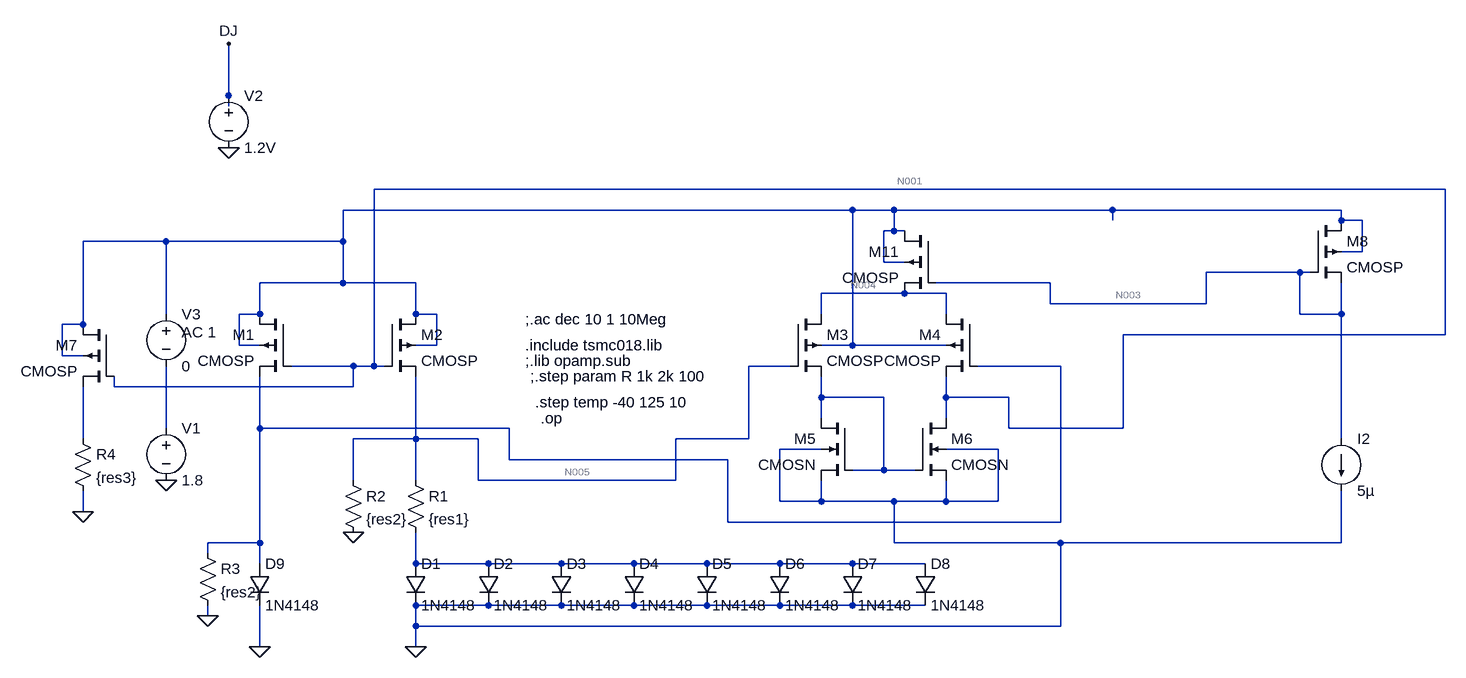
[diagram p0: schematic project1.asc]
project1.asc, the LTspice schematic file:
Version 4.1
SHEET 1 1508 680
WIRE -368 -320 -368 -400
WIRE -368 -304 -368 -320
WIRE 1504 -176 -144 -176
WIRE 592 -144 -192 -144
WIRE 656 -144 592 -144
WIRE 992 -144 656 -144
WIRE 1344 -144 992 -144
WIRE 992 -128 992 -144
WIRE 1344 -128 1344 -144
WIRE 1376 -128 1344 -128
WIRE 656 -112 656 -144
WIRE 656 -112 640 -112
WIRE 672 -112 656 -112
WIRE -464 -96 -592 -96
WIRE -192 -96 -192 -144
WIRE -192 -96 -464 -96
WIRE 1376 -80 1376 -128
WIRE 1376 -80 1344 -80
WIRE 640 -64 640 -112
WIRE 672 -64 640 -64
WIRE 1280 -48 1136 -48
WIRE 1296 -48 1280 -48
WIRE -192 -32 -192 -96
WIRE -192 -32 -320 -32
WIRE -80 -32 -192 -32
WIRE 896 -32 720 -32
WIRE 672 -16 544 -16
WIRE 736 -16 672 -16
WIRE 896 0 896 -32
WIRE 1136 0 1136 -48
WIRE 1136 0 896 0
WIRE -464 16 -464 -96
WIRE -320 16 -320 -32
WIRE -320 16 -352 16
WIRE -80 16 -80 -32
WIRE -48 16 -80 16
WIRE 544 16 544 -16
WIRE 736 16 736 -16
WIRE 1280 16 1280 -48
WIRE 1344 16 1344 -32
WIRE 1344 16 1280 16
WIRE -592 32 -592 -96
WIRE -592 32 -624 32
WIRE 1504 48 1504 -176
WIRE 1504 48 1008 48
WIRE -352 64 -352 16
WIRE -320 64 -352 64
WIRE -48 64 -48 16
WIRE -48 64 -80 64
WIRE 592 64 592 -144
WIRE 592 64 544 64
WIRE 736 64 592 64
WIRE -624 80 -624 32
WIRE -592 80 -624 80
WIRE -176 96 -272 96
WIRE -144 96 -144 -176
WIRE -144 96 -176 96
WIRE -128 96 -144 96
WIRE 496 96 432 96
WIRE 912 96 784 96
WIRE -544 128 -544 112
WIRE -176 128 -176 96
WIRE -176 128 -544 128
WIRE 544 144 544 112
WIRE 640 144 544 144
WIRE 736 144 736 112
WIRE 832 144 736 144
WIRE 544 176 544 144
WIRE 736 176 736 144
WIRE -464 192 -464 96
WIRE -320 192 -320 112
WIRE 64 192 -320 192
WIRE 832 192 832 144
WIRE 1008 192 1008 48
WIRE 1008 192 832 192
WIRE -592 208 -592 128
WIRE -80 208 -80 112
WIRE -80 208 -176 208
WIRE 16 208 -80 208
WIRE 432 208 432 96
WIRE 432 208 320 208
WIRE 1344 208 1344 16
WIRE 544 224 480 224
WIRE 816 224 736 224
WIRE 64 240 64 192
WIRE 400 240 64 240
WIRE 640 256 640 144
WIRE 640 256 592 256
WIRE 688 256 640 256
WIRE -176 272 -176 208
WIRE -80 272 -80 208
WIRE 16 272 16 208
WIRE 320 272 320 208
WIRE 320 272 16 272
WIRE 480 304 480 224
WIRE 544 304 544 272
WIRE 544 304 480 304
WIRE 656 304 544 304
WIRE 736 304 736 272
WIRE 736 304 656 304
WIRE 816 304 816 224
WIRE 816 304 736 304
WIRE -592 320 -592 288
WIRE 400 336 400 240
WIRE 912 336 912 96
WIRE 912 336 400 336
WIRE -320 368 -320 192
WIRE -320 368 -400 368
WIRE 656 368 656 304
WIRE 912 368 656 368
WIRE 1344 368 1344 288
WIRE 1344 368 912 368
WIRE -400 384 -400 368
WIRE -320 400 -320 368
WIRE -80 400 -80 352
WIRE 32 400 -80 400
WIRE 144 400 32 400
WIRE 256 400 144 400
WIRE 368 400 256 400
WIRE 480 400 368 400
WIRE 592 400 480 400
WIRE 704 400 592 400
WIRE 32 464 -80 464
WIRE 144 464 32 464
WIRE 256 464 144 464
WIRE 368 464 256 464
WIRE 480 464 368 464
WIRE 592 464 480 464
WIRE 704 464 592 464
WIRE -400 480 -400 464
WIRE -80 496 -80 464
WIRE 912 496 912 368
WIRE 912 496 -80 496
WIRE -320 528 -320 464
WIRE -80 528 -80 496
FLAG -80 528 0
FLAG -320 528 0
FLAG -464 272 0
FLAG -176 352 0
FLAG -400 480 0
FLAG -592 320 0
FLAG -368 -400 DJ
FLAG -368 -240 0
SYMBOL cmosp -272 16 M0
SYMATTR InstName M1
SYMATTR Value2 l=0.3u w=1u ad=0.36e-12 as=0.36e-12 pd=2.72e-6 ps=2.72e-6 m={current_mirror}
SYMBOL cmosp -128 16 R0
SYMATTR InstName M2
SYMATTR Value2 l=0.3u w=1u ad=0.36e-12 as=0.36e-12 pd=2.72e-6 ps=2.72e-6 m={current_mirror}
SYMBOL res -96 256 R0
SYMATTR InstName R1
SYMATTR Value {res1}
SYMBOL diode -96 400 R0
SYMATTR InstName D1
SYMATTR Value 1N4148
SYMBOL diode 16 400 R0
SYMATTR InstName D2
SYMATTR Value 1N4148
SYMBOL diode 128 400 R0
SYMATTR InstName D3
SYMATTR Value 1N4148
SYMBOL diode 240 400 R0
SYMATTR InstName D4
SYMATTR Value 1N4148
SYMBOL diode 352 400 R0
SYMATTR InstName D5
SYMATTR Value 1N4148
SYMBOL diode 464 400 R0
SYMATTR InstName D6
SYMATTR Value 1N4148
SYMBOL diode 576 400 R0
SYMATTR InstName D7
SYMATTR Value 1N4148
SYMBOL diode 688 400 R0
SYMATTR InstName D8
SYMATTR Value 1N4148
SYMBOL voltage -464 176 R0
WINDOW 123 0 0 Left 0
WINDOW 39 0 0 Left 0
SYMATTR InstName V1
SYMATTR Value 1.8
SYMBOL diode -336 400 R0
SYMATTR InstName D9
SYMATTR Value 1N4148
SYMBOL cmosp 496 16 R0
SYMATTR InstName M3
SYMATTR Value2 l=0.3u w=1u ad=0.36e-12 as=0.36e-12 pd=2.72e-06 ps=2.72e-06 m={input}
SYMBOL cmosp 784 16 M0
SYMATTR InstName M4
SYMATTR Value2 l=0.3u w=1u ad=0.36e-12 as=0.36e-12 pd=2.72e-06 ps=2.72e-06 m={input}
SYMBOL cmosn 592 176 M0
SYMATTR InstName M5
SYMATTR Value2 l=0.3u w=1u ad=0.36e-12 as=0.36e-12 pd=2.72e-06 ps=2.72e-06 m={active}
SYMBOL cmosn 688 176 R0
SYMATTR InstName M6
SYMATTR Value2 l=0.3u w=1u ad=0.36e-12 as=0.36e-12 pd=2.72e-06 ps=2.72e-06 m={active}
SYMBOL res -192 256 R0
SYMATTR InstName R2
SYMATTR Value {res2}
SYMBOL res -416 368 R0
SYMATTR InstName R3
SYMATTR Value {res2}
SYMBOL cmosp -544 32 M0
SYMATTR InstName M7
SYMATTR Value2 l=0.3u w=1u ad=0.36e-12 as=0.36e-12 pd=2.72e-6 ps=2.72e-6 m={current_mirror}
SYMBOL res -608 192 R0
SYMATTR InstName R4
SYMATTR Value {res3}
SYMBOL voltage -368 -336 R0
WINDOW 123 0 0 Left 0
WINDOW 39 0 0 Left 0
SYMATTR InstName V2
SYMATTR Value 1.2V
SYMBOL voltage -464 0 R0
WINDOW 123 24 44 Left 2
WINDOW 39 0 0 Left 0
SYMATTR Value2 AC 1
SYMATTR InstName V3
SYMATTR Value 0
SYMBOL current 1344 208 R0
WINDOW 123 0 0 Left 0
WINDOW 39 0 0 Left 0
SYMATTR InstName I2
SYMATTR Value 5µ
SYMBOL cmosp 1296 -128 R0
SYMATTR InstName M8
SYMATTR Value2 l=0.3u w=1u ad=0.36e-12 as=0.36e-12 pd=2.72e-6 ps=2.72e-6 m={bias}
SYMBOL cmosp 720 -112 M0
SYMATTR InstName M11
SYMATTR Value2 l=0.3u w=1u ad=0.36e-12 as=0.36e-12 pd=2.72e-6 ps=2.72e-6 m={tail}
TEXT 96 112 Left 2 !;.step param R 1k 2k 100
TEXT 104 152 Left 2 !.step temp -40 125 10
TEXT 112 176 Left 2 !.op
TEXT 88 88 Left 2 !;.lib opamp.sub
TEXT 88 64 Left 2 !.include tsmc018.lib
TEXT 88 24 Left 2 !;.ac dec 10 1 10Meg

The netlist it stands for:
* project1.asc
M1 N002 N001 N006 N002 CMOSP l=0.3u w=1u ad=0.36e-12 as=0.36e-12 pd=2.72e-6 ps=2.72e-6 m={current_mirror}
M2 N002 N001 N005 N002 CMOSP l=0.3u w=1u ad=0.36e-12 as=0.36e-12 pd=2.72e-6 ps=2.72e-6 m={current_mirror}
R1 N005 N010 {res1}
D1 N010 0 1N4148
D2 N010 0 1N4148
D3 N010 0 1N4148
D4 N010 0 1N4148
D5 N010 0 1N4148
D6 N010 0 1N4148
D7 N010 0 1N4148
D8 N010 0 1N4148
V1 N008 0 1.8
D9 N006 0 1N4148
M3 N004 N005 N007 N002 CMOSP l=0.3u w=1u ad=0.36e-12 as=0.36e-12 pd=2.72e-06 ps=2.72e-06 m={input}
M4 N004 N006 N001 N002 CMOSP l=0.3u w=1u ad=0.36e-12 as=0.36e-12 pd=2.72e-06 ps=2.72e-06 m={input}
M5 N007 N007 0 0 CMOSN l=0.3u w=1u ad=0.36e-12 as=0.36e-12 pd=2.72e-06 ps=2.72e-06 m={active}
M6 N001 N007 0 0 CMOSN l=0.3u w=1u ad=0.36e-12 as=0.36e-12 pd=2.72e-06 ps=2.72e-06 m={active}
R2 N005 0 {res2}
R3 N006 0 {res2}
M7 N002 N001 N009 N002 CMOSP l=0.3u w=1u ad=0.36e-12 as=0.36e-12 pd=2.72e-6 ps=2.72e-6 m={current_mirror}
R4 N009 0 {res3}
V2 DJ 0 1.2V
V3 N002 N008 0 AC 1
I2 N003 0 5µ
M8 N002 N003 N003 N002 CMOSP l=0.3u w=1u ad=0.36e-12 as=0.36e-12 pd=2.72e-6 ps=2.72e-6 m={bias}
M11 N002 N003 N004 N002 CMOSP l=0.3u w=1u ad=0.36e-12 as=0.36e-12 pd=2.72e-6 ps=2.72e-6 m={tail}
.model D D
.lib standard.dio
.model NMOS NMOS
.model PMOS PMOS
.lib standard.mos
;.step param R 1k 2k 100
.step temp -40 125 10
.op
;.lib opamp.sub
.include tsmc018.lib
;.ac dec 10 1 10Meg
.backanno
.end

* Results of the author's LTspice run, read from the files saved beside the schematic
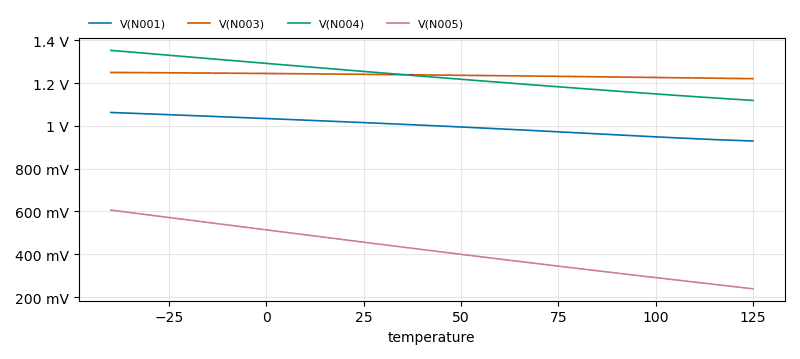
[diagram p1: Operating Point of project1.asc, plotted from the saved traces]
* Operating Point, 1 run:
*   V(N001): 1.063 V at temperature=-40 , 929.4 mV at temperature=125 , min 929.4 mV, max 1.063 V
*   V(N003): 1.25 V at temperature=-40 , 1.221 V at temperature=125 , min 1.221 V, max 1.25 V
*   V(N004): 1.353 V at temperature=-40 , 1.119 V at temperature=125 , min 1.119 V, max 1.353 V
*   V(N005): 606.3 mV at temperature=-40 , 238.5 mV at temperature=125 , min 238.5 mV, max 606.3 mV